# EAGLE design Blinky (EAGLE 8.3.1)
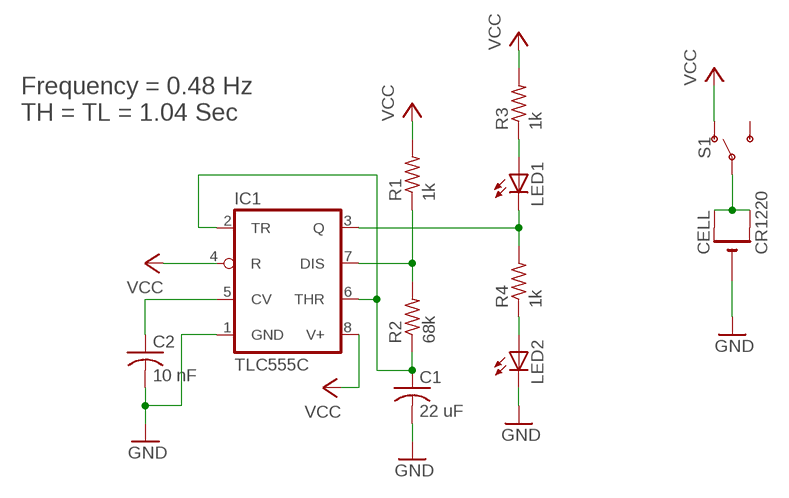
[diagram p0: schematic, sheet 1]

## Parts
C1  22 uF  C-USC1206  [C1206]
C2  10 nF  C-USC1206  [C1206]
CELL  CR1220  CR1220SMT  [CR1220-SMD]
IC1  TLC555C  LM555D  [SO08]
LED1  LEDCHIPLED_1206  [CHIPLED_1206]
LED2  LEDCHIPLED_1206  [CHIPLED_1206]
R1  1k  R-US_R1206  [R1206]
R2  68k  R-US_R1206  [R1206]
R3  1k  R-US_R1206  [R1206]
R4  1k  R-US_R1206  [R1206]
S1  SWITCH-SPDT-SMD-RIGHT-ANGLE  [SWITCH_SPST_SMD_A]

## Nets
GND: C1.2 C2.2 CELL.- IC1.1(GND) LED2.C
N$1: C2.1 IC1.5(CV)
N$2: IC1.7(DIS) R1.1 R2.2
N$3: C1.1 IC1.2(TR) IC1.6(THR) R2.1
N$4: CELL.+$1(+) CELL.+$2(+1) S1.2(P)
N$7: LED1.A R3.1
N$8: IC1.3(Q) LED1.C R4.2
N$9: LED2.A R4.1
VCC: IC1.4(R) IC1.8(V+) R1.2 R3.2 S1.1(O)
Unconnected: S1.3(S)

## Notes on the sheet
- Frequency = 0.48 Hz
  TH = TL = 1.04 Sec

## Library data of the parts
C1 C2 = Blinky:C-US: CAPACITOR, American symbol
CELL = Blinky:CR1220: CR1216/CR1220/CR1225 12mm 3V lithium coin cell Great for battery packup. Both SMT and THM holders. Note the THM package has the ground pads on both sides of the PCB so that the masks are the same - this reduces the cost
IC1 = Blinky:*555: TIMER Changed DIP package to have round (not oval) pin pads http://www.ladyada.net/library/pcb/eaglelibrary.html
LED1 LED2 = Blinky:LED: LED OSRAM: - CHIPLED LG R971, LG N971, LY N971, LG Q971, LY Q971, LO R971, LY R971 LH N974, LH R974 LS Q976, LO Q976, LY Q976 LO Q996 - Hyper CHIPLED LW Q18S LB Q993, LB Q99A, LB R99A - SideLED LS A670, LO A670, LY A670, LG A670, LP A670 LB A673, LV A673, LT A673, LW A673 LH A674 LY A675 LS A676, LA A676, LO A676, LY A676, LW A676 LS A679, LY A679, LG A679 - Hyper Micro SIDELED® LS Y876, LA Y876, LO Y876, LY Y876 LT Y87S - SmartLED LW L88C, LW L88S LB L89C, LB L89S, LG L890 LS L89K, LO L89K, LY L89K LS L896, LA L896, LO L896, LY L896 - TOPLED LS T670, LO T670, LY T670, LG T670, LP T670 LSG T670, LSP T670, LSY T670, LOP T670, LYG T670 LG T671, LOG T671, LSG T671 LB T673, LV T673, LT T673, LW T673 LH T674 LS T676, LA T676, LO T676, LY T676, LB T676, LH T676, LSB T676, LW T676 LB T67C, LV T67C, LT T67C, LS T67K, LO T67K, LY T67K, LW E67C LS E67B, LA E67B, LO E67B, LY E67B, LB E67C, LV E67C, LT E67C LW T67C LS T679, LY T679, LG T679 LS T770, LO T770, LY T770, LG T770, LP T770 LB T773, LV T773, LT T773, LW T773 LH T774 LS E675, LA E675, LY E675, LS T675 LS T776, LA T776, LO T776, LY T776, LB T776 LHGB T686 LT T68C, LB T68C - Hyper Mini TOPLED® LB M676 - Mini TOPLED Santana® LG M470 LS M47K, LO M47K, LY M47K Source: http://www.osram.convergy.de/
R1-R4 = Blinky:R-US_: RESISTOR, American symbol
S1 = Blinky:SWITCH-SPDT: Single Pole, Double Throw (SPDT) Switch Single-pole, double-throw (SPDT) switch. Variant Overview SMD-AYZ0202 Surface Mount DPDT Switch <https://www.sparkfun.com/products/597> (COM-00597) Used on e.g. LilyPad Arduino USB - ATmega32U4 Board <https://www.sparkfun.com/products/12049> PTH-11.6X4.0MM SPDT Mini Power Switch <https://www.sparkfun.com/products/102> (COM-00102) Used on e.g. SparkFun Simon Says - Through-Hole Soldering Kit <https://www.sparkfun.com/products/10547> (KIT-10547) PTH-11.6X4.0MM-KIT KIT version of SPDT Mini Power Switch - Simplifies soldering by removing tStop of switch pins - only one side can be soldered. PTH-11.6X4.0MM-LOCK LOCK version of SPDT Mini Power Switch - Offset pins hold switch in place for easier soldering. SMD-RIGHT-ANGLE Surface Mount Right Angle Switch <https://www.sparkfun.com/products/10860> (COM-10860) Used on e.g. SparkFun ESP8266 Thing <https://www.sparkfun.com/products/13231>; PROD_ID: SWCH-10651; SF_SKU: COM-10860

## Net classes
0 default: width 0.406 mm, clearance 0.203 mm

## Board
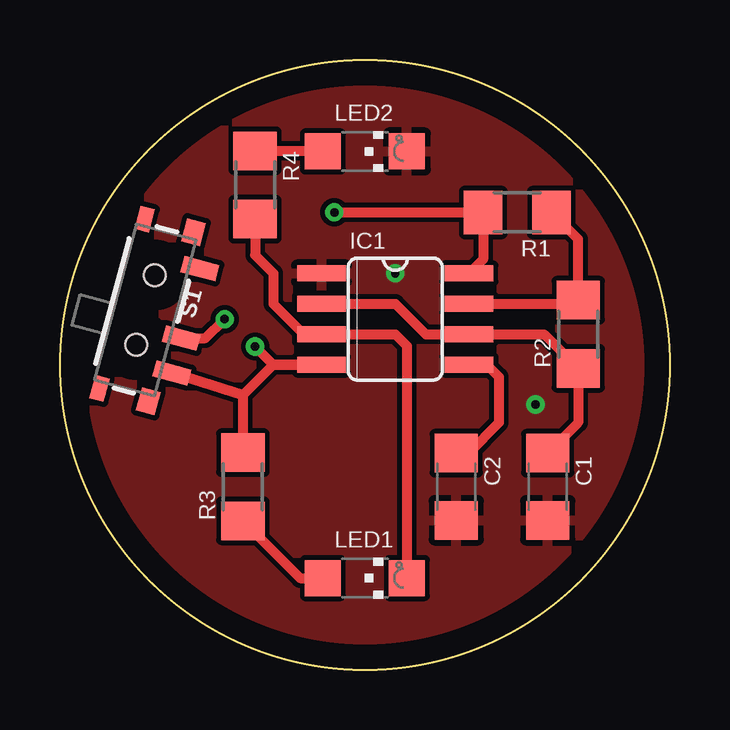
[diagram p1: board, top side]
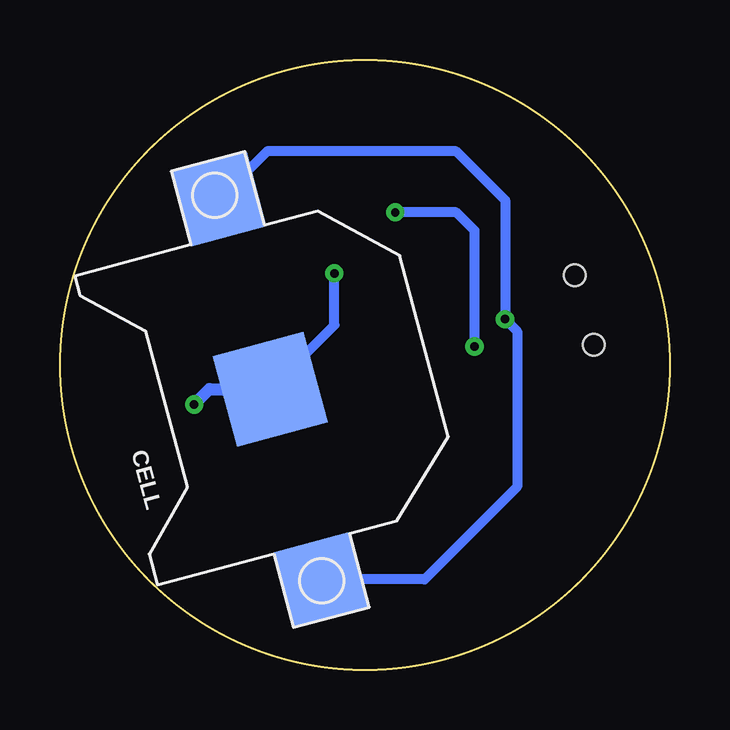
[diagram p2: board, bottom side, seen from below]

Size 25.4 x 25.4 mm. Coordinates in mm from the lower left corner, seen from the top.
Outline: circle at 12.7,12.7 radius 12.7
Copper layers (1*16): Top 0.035mm / dielectric 1.5mm / Bottom 0.035mm
Design rules "default": minimum track width 6mil, minimum drill 0.35mm, track to track 6mil, track to pad 6mil, pad to pad 6mil, via to via 6mil, smd to smd 6mil, copper to edge 40mil, drill to drill 6mil, minimum pad ring 10mil, minimum via ring 8mil, stop-mask expansion 4mil, vias tented up to drill 0mil, thermal gap 10mil

### Footprints (pad centres in the part's own frame; a part is rotated, then mirrored left to right if it is on the bottom)
C1206 = smd 1.6 x 1.8: 1 -1.4,0; 2 1.4,0
CR1220-SMD = smd 3.2 x 3.2: +$1 -8.2,0; +$2 8.2,0 | smd 3.9 x 3.9: - 0,0
SO08 = smd 0.66 x 2.032: 1 -1.905,-3.073; 2 -0.635,-3.073; 3 0.635,-3.073; 4 1.905,-3.073; 5 1.905,3.073; 6 0.635,3.073; 7 -0.635,3.073; 8 -1.905,3.073
CHIPLED_1206 = smd 1.5 x 1.5: A 0,-1.75; C 0,1.75
R1206 = smd 1.6 x 1.803: 1 -1.422,0; 2 1.422,0
SWITCH_SPST_SMD_A = smd 0.7 x 1.5: 1 -2.25,-1.75; 2 -0.75,-1.75; 3 2.25,-1.75 | smd 1 x 0.6: GND1 -3.65,1; GND3 3.65,1 | smd 1 x 0.8: GND2 -3.65,-1.1; GND4 3.65,-1.1 | hole 0.9: -1.5,0; 1.5,0

### Placement (x,y rotation side)
C1  20.32,7.62 270 top
C2  16.51,7.62 270 top
CELL  16.64,11.68 105 bottom
IC1  13.97,14.61 270 top
LED1  12.7,3.81 270 top
LED2  12.7,21.59 270 top
R1  19.05,19.05 180 top
R2  21.59,13.97 90 top
R3  7.62,7.62 90 top
R4  8.13,20.19 270 top
S1  3.56,14.99 75 top

### Tracks (layer width: path | path; a pad name or v marks a point on that pad's centre or on a via)
GND  (via drill 0.35)
  Bottom 0.406: CELL.- 13.97,14.35 v13.97,16.51
  Bottom 0.508: CELL.- 19.18,11.68 v19.81,11.05
  pour Top: 0,0 25.4,0 25.4,25.4 0,25.4
N$1
  Top 0.406: IC1.5 17.78,12.7 18.29,12.19 18.29,10.29 17.02,9.02 C2.1
N$2
  Top 0.406: R1.1 21.59,17.93 21.59,15.68 | 21.59,15.68 R2.2 | IC1.7 21.15,15.24 21.59,15.68
N$3
  Top 0.406: C1.1 21.59,10.29 R2.1 20.17,13.97 IC1.6 15.24,13.97 13.97,15.24 IC1.2
N$4  (via drill 0.35)
  Top 0.406: S1.2 6.06,13.81 v6.86,14.61
  Bottom 0.406: CELL.+$2 16.77,21.59 8.89,21.59 6.86,19.56 v6.86,14.61 6.35,14.1 6.35,7.62 10.21,3.76 CELL.+$1
N$7
  Top 0.406: R3.1 10.01,3.81 LED1.A
N$8
  Top 0.406: 11.27,13.97 IC1.3 | 11.27,13.97 13.97,13.97 14.45,13.49 LED1.C | R4.2 8.13,17.27 8.89,16.51 8.89,15.24 10.16,13.97 11.27,13.97
N$9
  Top 0.406: R4.1 10.93,21.61 LED2.A
VCC  (via drill 0.35)
  Top 0.406: IC1.8 17.63,17.09 R1.2 v11.43,19.05 | 7.62,11.43 S1.1 | 7.62,11.43 R3.2 | 8.89,12.7 IC1.4 8.89,12.7 | 8.89,12.7 7.62,11.43 | 8.89,12.7 v8.13,13.46
  Bottom 0.406: v8.13,13.46 8.13,18.29 8.89,19.05 v11.43,19.05